# Altium schematic sheet New Power (Becca).SchDoc
size A
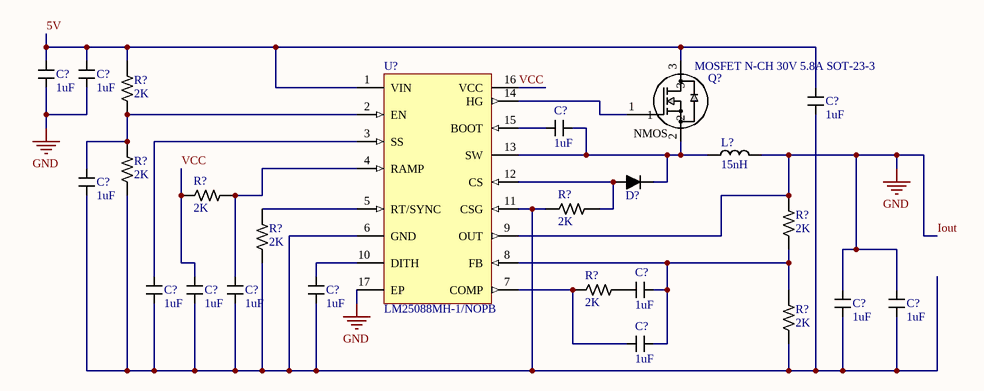
[diagram p0: New Power (Becca).SchDoc]

## Parts
(Parts that share a designator on the sheet are numbered #1, #2 ... from top to bottom, then left to right.)
C?#1  value 1uF  [CAPACITOR_0402]  (hidden comment: 1uF Ceramic 16V)
C?#2  value 1uF  [CAPACITOR_0402]  (hidden comment: 1uF Ceramic 16V)
C?#3  value 1uF  [CAPACITOR_0402]  (hidden comment: 1uF Ceramic 16V)
C?#4  value 1uF  [CAPACITOR_0402]  (hidden comment: 1uF Ceramic 16V)
C?#5  value 1uF  [CAPACITOR_0402]  (hidden comment: 1uF Ceramic 16V)
C?#6  value 1uF  [CAPACITOR_0402]  (hidden comment: 1uF Ceramic 16V)
C?#7  value 1uF  [CAPACITOR_0402]  (hidden comment: 1uF Ceramic 16V)
C?#8  value 1uF  [CAPACITOR_0402]  (hidden comment: 1uF Ceramic 16V)
C?#9  value 1uF  [CAPACITOR_0402]  (hidden comment: 1uF Ceramic 16V)
C?#10  value 1uF  [CAPACITOR_0402]  (hidden comment: 1uF Ceramic 16V)
C?#11  value 1uF  [CAPACITOR_0402]  (hidden comment: 1uF Ceramic 16V)
C?#12  value 1uF  [CAPACITOR_0402]  (hidden comment: 1uF Ceramic 16V)
C?#13  value 1uF  [CAPACITOR_0402]  (hidden comment: 1uF Ceramic 16V)
D?  MBR0520LT3G  [SOD-123]  (value not drawn)
L?  value 15nH  [INDUCTOR_0402]  (hidden comment: FIXED IND 15NH 250MA 600MOHM SMD)
Q?  MOSFET N-CH 30V 5.8A SOT-23-3  [SOT-23-3]
R?#1  Value  (Ohms): 2K  [RESISTOR_0402]  (hidden comment: 2k Ohm 1% 1/16W)
R?#2  Value  (Ohms): 2K  [RESISTOR_0402]  (hidden comment: 2k Ohm 1% 1/16W)
R?#3  Value  (Ohms): 2K  [RESISTOR_0402]  (hidden comment: 2k Ohm 1% 1/16W)
R?#4  Value  (Ohms): 2K  [RESISTOR_0402]  (hidden comment: 2k Ohm 1% 1/16W)
R?#5  Value  (Ohms): 2K  [RESISTOR_0402]  (hidden comment: 2k Ohm 1% 1/16W)
R?#6  Value  (Ohms): 2K  [RESISTOR_0402]  (hidden comment: 2k Ohm 1% 1/16W)
R?#7  Value  (Ohms): 2K  [RESISTOR_0402]  (hidden comment: 2k Ohm 1% 1/16W)
R?#8  Value  (Ohms): 2K  [RESISTOR_0402]  (hidden comment: 2k Ohm 1% 1/16W)
U?  LM25088MH-1/NOPB  [PWP0016A_N]

## Nets
Iout: C?#1.2 C?#2.2 C?#11.1 C?#12.1 L?.1 R?#5.1 U?.9(OUT) U?.17(EP)  [also labelled GND]
5V: C?#1.1 C?#2.1 C?#3.1 Q?.3 R?#1.1 U?.1(VIN)
VCC: C?#7.1 R?#3.2 U?.16(VCC)
NetC?#3_2: C?#3.2 C?#5.2 C?#6.2 C?#7.2 C?#8.2 C?#9.2 C?#11.2 C?#12.2 R?#2.2 R?#4.2 R?#6.2 R?#8.2 U?.6(GND) U?.11(CSG)
NetC?#4_1: C?#4.1 D?.2 L?.2 Q?.2 U?.13(SW)
NetC?#4_2: C?#4.2 U?.15(BOOT)
NetC?#5_1: C?#5.1 R?#1.2 R?#2.1 U?.2(EN)
NetC?#6_1: C?#6.1 U?.3(SS)
NetC?#8_1: C?#8.1 R?#3.1 U?.4(RAMP)
NetC?#9_1: C?#9.1 U?.10(DITH)
NetC?#10_1: C?#10.1 C?#13.1 R?#5.2 R?#8.1 U?.8(FB)
NetC?#10_2: C?#10.2 R?#7.1
NetC?#13_2: C?#13.2 R?#7.2 U?.7(COMP)
NetD?_1: D?.1 R?#4.1 U?.12(CS)
NetQ?_1: Q?.1 U?.14(HG)
NetR?#6_1: R?#6.1 U?.5(RT/SYNC)

## Notes on the sheet
- (in symbol AO3404A) NMOS

## Library data of the parts
C?#1-C?#13 = CAPACITOR_1uF_0402: Cap 1uF 16V +/-10% / Ceramic 0402; Made By: Robert Pafford; Tolerance: +/- 10%; Voltage: 16V; Supplier 1: Digi-Key; Supplier Part Number 1: 478-0402YD105KAT4ADKR-ND
D? = SCHOTTKY_20V_500mA: Schottky Diode, 20V reverse breakdown, 500mA, Vf = 0.385V; Made By: Flip B; ComponentLink1Description: Datasheet; ComponentLink1URL: https://www.onsemi.com/pdf/datasheet/mbr0520lt1-d.pdf; Forward Voltage: 0.385V; Forward Current: 500mA; Package: SOD-123; Supplier 1: Digi-Key; Supplier Part Number 1: MBR0520LT3GOSCT-ND
L? = INDUCTOR_15nH_0402: 15 nH Unshielded Multilayer Inductor 250 mA 600mOhm Max 0402 (1005 Metric); Tolerance: +/- 5%
Q? = AO3404A: N-Channel 30 V 5.8A (Ta) 1.4W (Ta) Surface Mount SOT-23-3; Vendor: Alpha & Omega Semiconductor Inc.; SourceLibrary: ON_Semiconductor_2020-01-13; Vgs (Max): 3V @ 5.8A, 10V; Vgs (th): 3V @ 250µA; Rds (on): 28mOhm @ 5.8A, 10V; Amp Rating: 5.8 A; FET Type: N-Channel; Package: SOT23-3L; Manufacturer _Part_Number: AO3404A; Vdss: 30V; Power Dissipation: 1.4W (Ta); Supplier 1: Digi-Key; Supplier Part Number 1: 785-1004-1-ND; Created By: Dylan T
R?#1-R?#8 = RESISTOR_2K_0402: RES 2k OHM 1% 1/16W 0402; Tolerance: +/- 1%; Made By: Flip B; Wattage: 1/16W; Supplier 1: Digi-Key; Supplier Part Number 1: 311-2KLRCT-ND
U? = CMP-0063-01290-3: Wide Input Range Non-Synchronous Buck Controller, 16-pin TSSOP-EP, Pb-Free; Manufacturer: Texas Instruments; PowerWise: Y; CompType: MiscPower; PackageTopMarking: NSUZXYTT*L25088*MH-1; Code_JEDEC: MO-153-ABT; PinCount: 16; ComponentLink1Description: Datasheet URL; RoHS: Y; PackageDescription: Molded TSSOP, Jedec, Exposed Pad, 5.0 x 4.4 x 0.9mm Body,16 Lead, 0.65mm Pitch; PackageReference: PWP0016A; ComponentLink1URL: http://www.ti.com/general/docs/lit/getliterature.tsp?genericPartNumber=LM25088&fileType=pdf